# EAGLE schematic Arduino Dots Matrix (EAGLE 7.5.0)

## Sheet 1 of 3
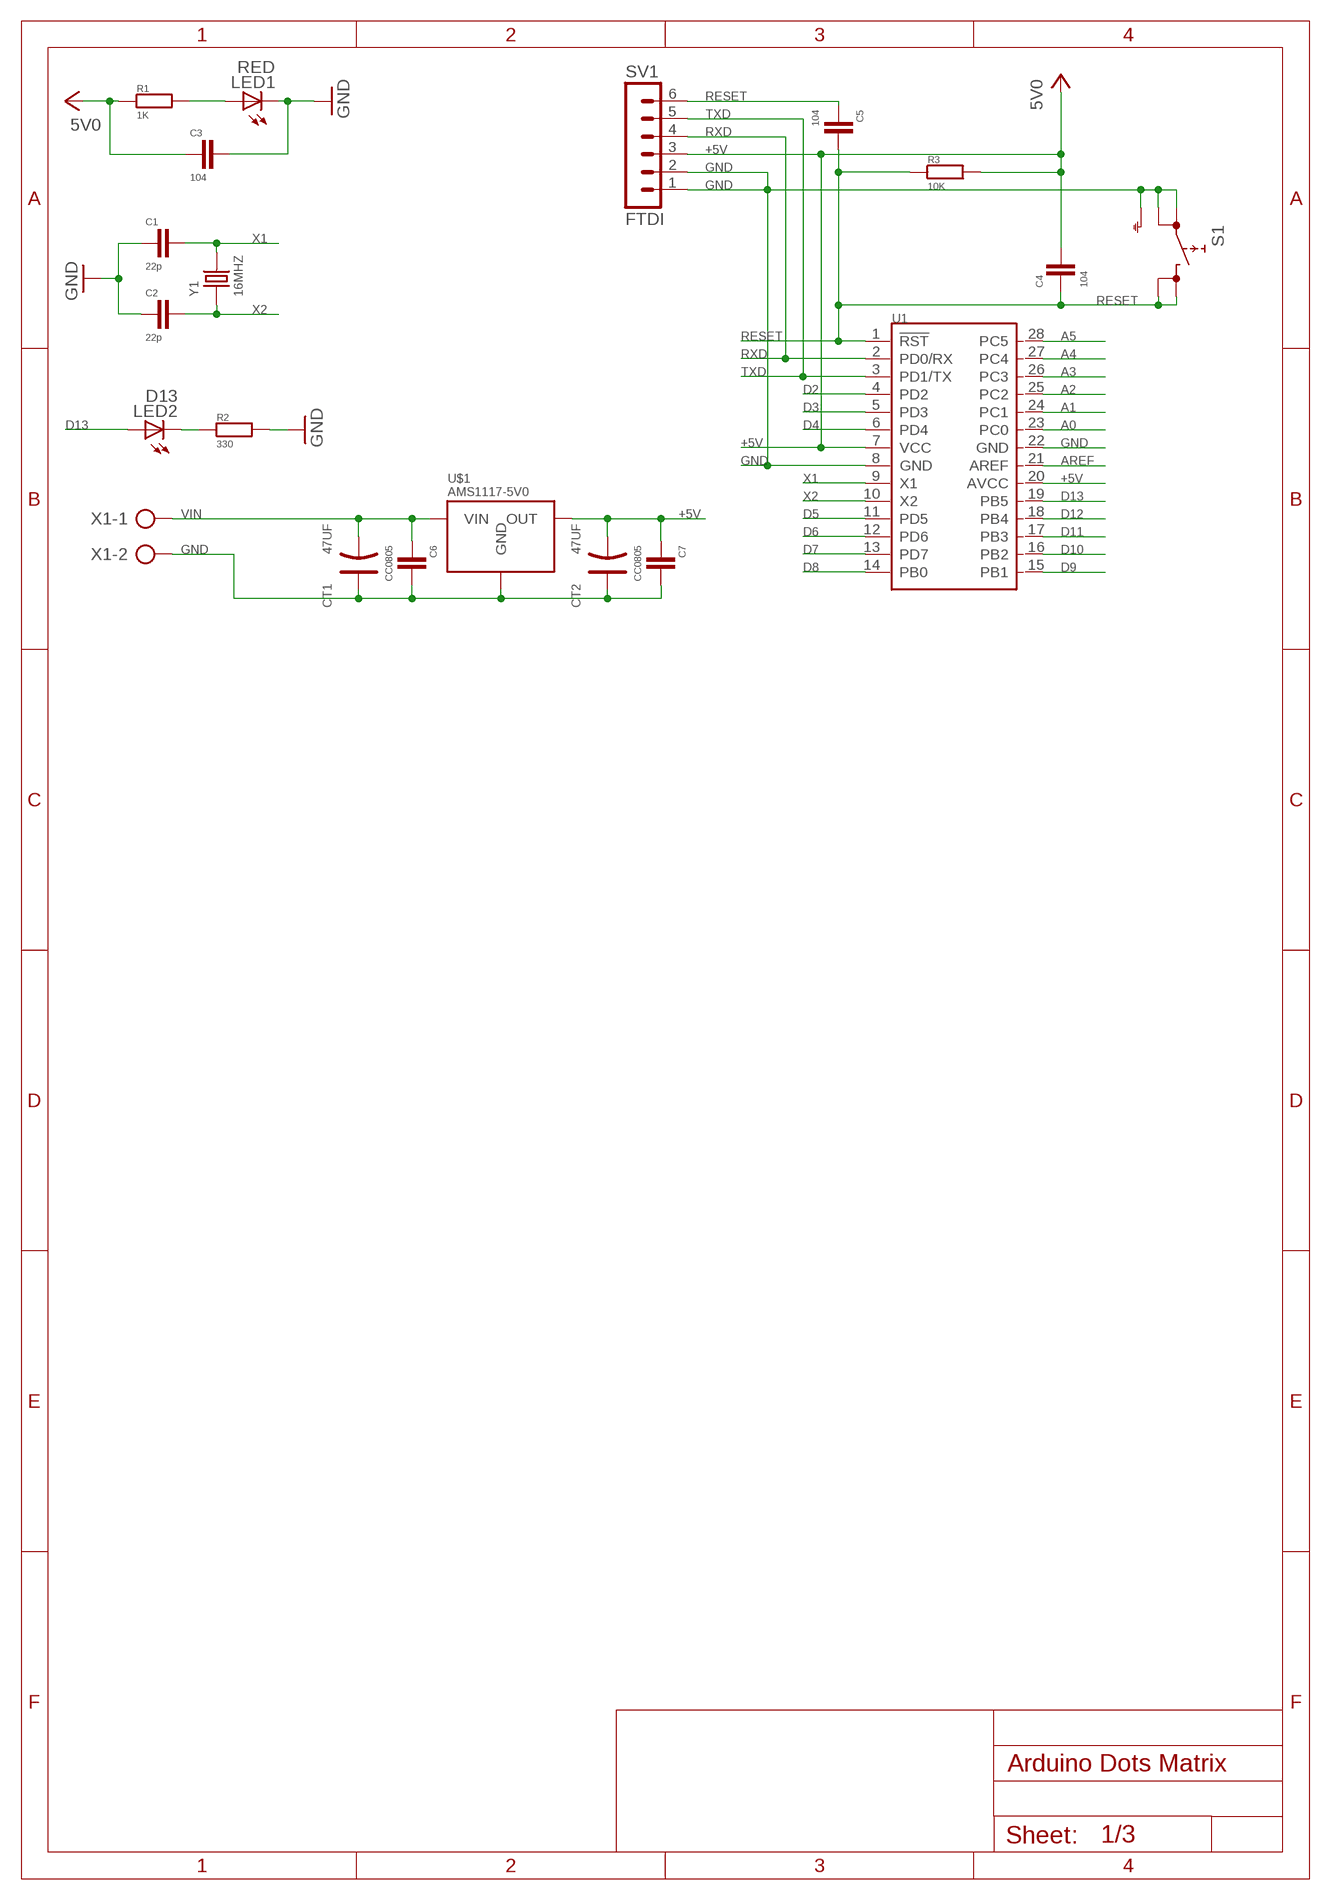
[diagram p0: schematic, sheet 1]

### Parts
C1  22p  CC0805  [C0805]
C2  22p  CC0805  [C0805]
C3  104  CC0805  [C0805]
C4  104  CC0805  [C0805]
C5  104  CC0805  [C0805]
C6  CC0805  [C0805]
C7  CC0805  [C0805]
CT1  47UF  ALUMINUM-SMD-47UF-25V(D6.3-H5.3MM)  [ELECTRO-SMD-C-6MM]
CT2  47UF  ALUMINUM-SMD-47UF-25V(D6.3-H5.3MM)  [ELECTRO-SMD-C-6MM]
LED1  RED  LEDCHIPLED_0805  [CHIPLED_0805]
LED2  D13  LEDCHIPLED_0805  [CHIPLED_0805]
R1  1K  RR0805  [R0805]
R2  330  RR0805  [R0805]
R3  10K  RR0805  [R0805]
S1  SKHMPSE010  [SKHMPXE010]
SV1  FTDI  MA06-1  [MA06-1]
U1  MCU-ATMEGA328P-PU(DIP28)  [DIP28-2.54-35.6X13.5MM]
U$1  AMS1117-5V0  AMS1117-5V0SOT22  [SOT223]
X1  AK500/2  [AK500/2]
Y1  16MHZ  DIP-CRYSTAL-16MHZ-18PF-30PPM-40R(HC49US)  [HC49US]

### Nets
+5V: C3.2 C4.1 C7.2 CT2.- R1.1 R3.2 SV1.3 U1.7(VCC) U1.20(AVCC) U$1.OUT ; supply symbol labelled 5V0 ; also sheet 2
A0: U1.23(PC0)
A1: U1.24(PC1)
A2: U1.25(PC2)
A3: U1.26(PC3)
A4: U1.27(PC4)
A5: U1.28(PC5)
AREF: U1.21(AREF)
D2: U1.4(PD2)
D3: U1.5(PD3)
D4: U1.6(PD4)
D5: U1.11(PD5)
D6: U1.12(PD6)
D7: U1.13(PD7)
D8: U1.14(PB0)
D9: U1.15(PB1)
D10: U1.16(PB2)
D11: U1.17(PB3)
D12: U1.18(PB4)
D13: LED2.A U1.19(PB5)
GND: C1.2 C2.2 C3.1 C6.1 C7.1 CT1.+ CT2.+ LED1.C R2.2 S1.1(1.1) S1.2(1.2) S1.5(SH) SV1.1 SV1.2 U1.8(GND) U1.22(GND) U$1.GND X1.2 ; also sheet 2
N$1: LED1.A R1.2
N$2: LED2.C R2.1
RESET: C4.2 C5.1 C5.2 R3.1 S1.3(2.1) S1.4(2.2) SV1.6 U1.1(!RST)
RXD: SV1.4 U1.2(PD0/RX)
TXD: SV1.5 U1.3(PD1/TX)
VIN: C6.2 CT1.- U$1.VIN X1.1
X1: C1.1 U1.9(X1) Y1.2
X2: C2.1 U1.10(X2) Y1.1

## Sheet 2 of 3
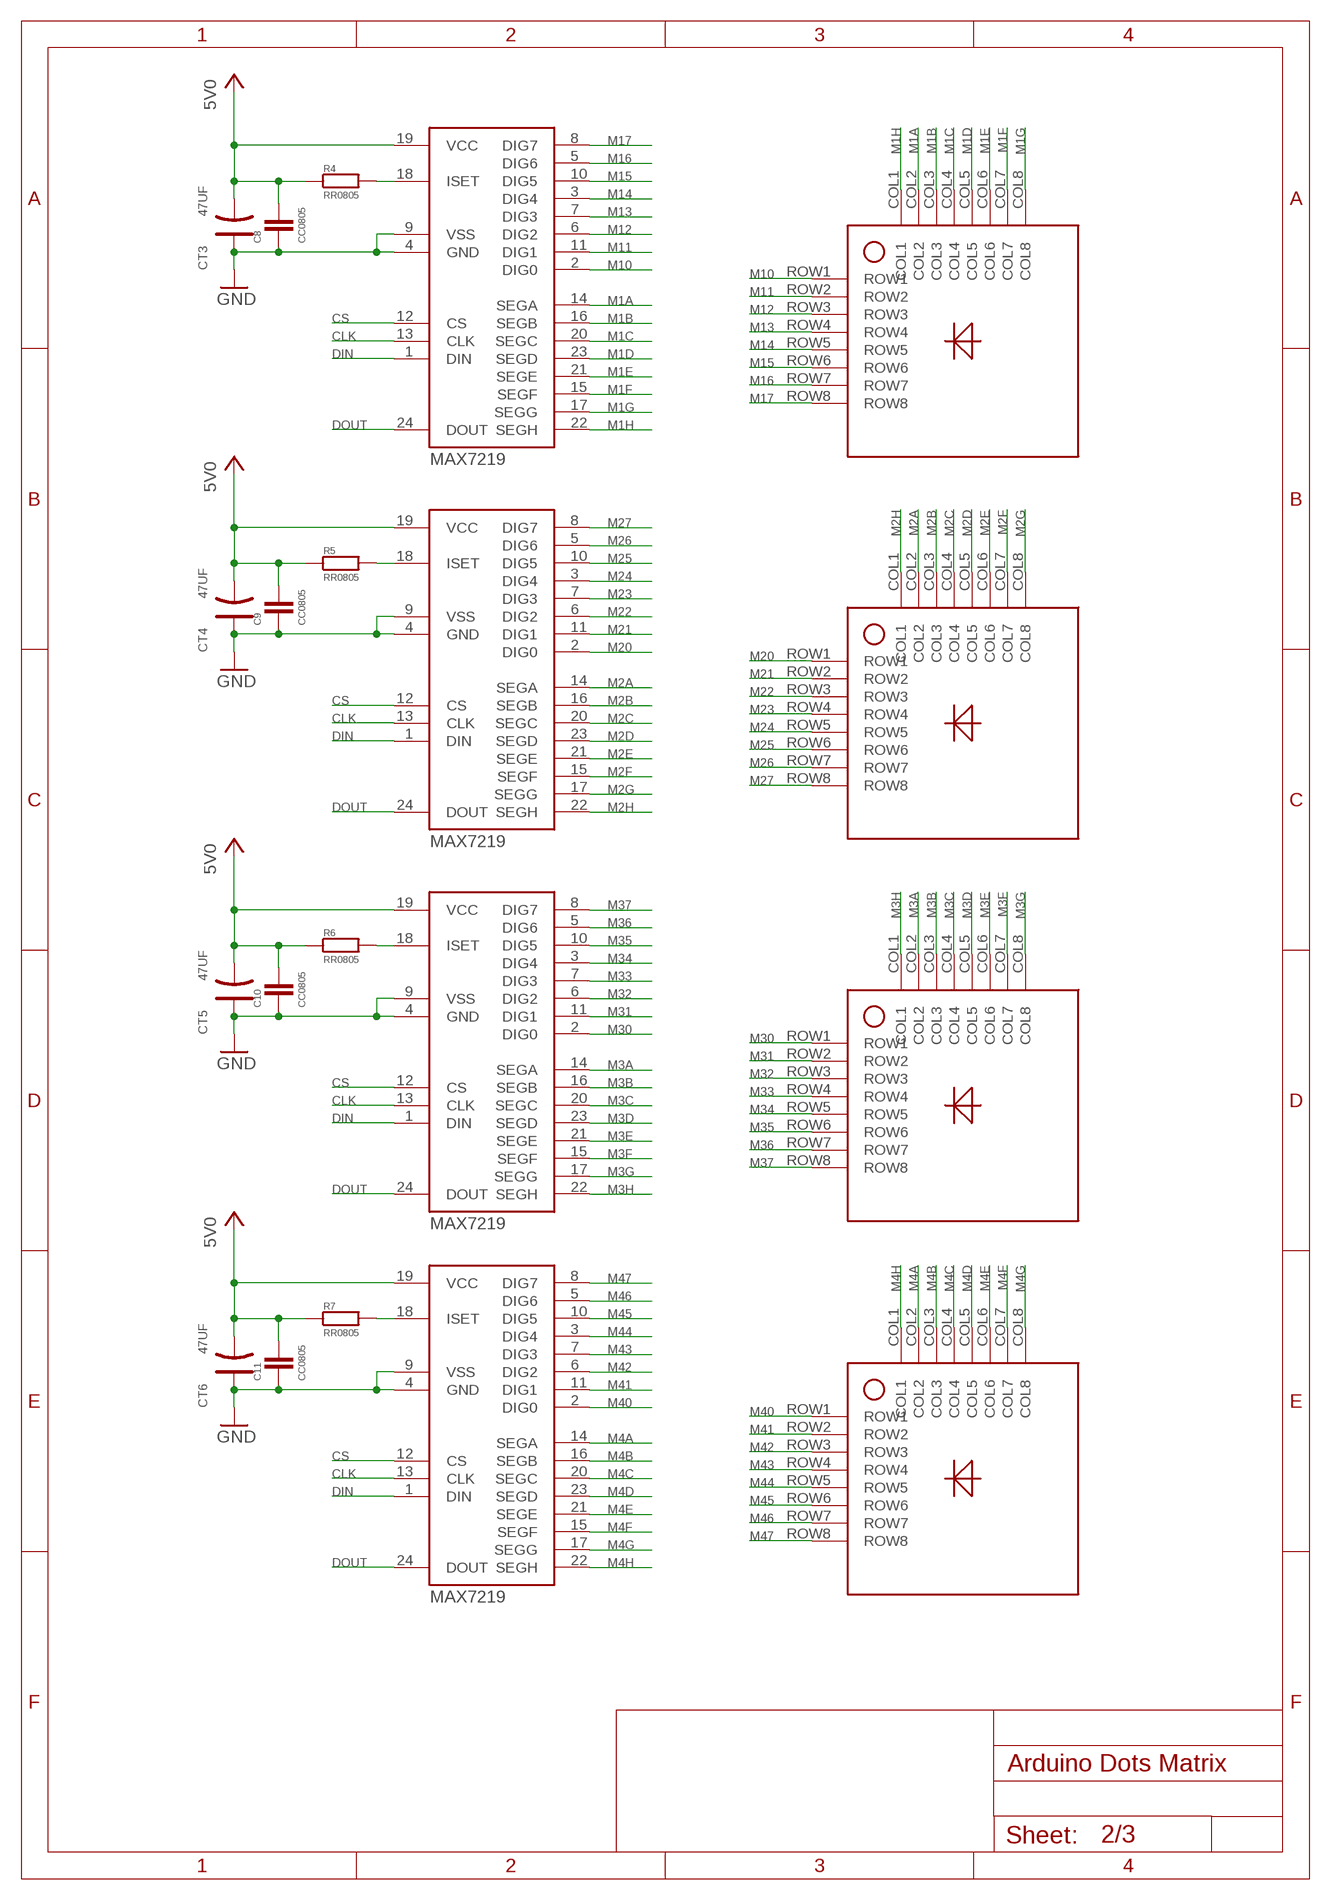
[diagram p1: schematic, sheet 2]

### Parts
C8  CC0805  [C0805]
C9  CC0805  [C0805]
C10  CC0805  [C0805]
C11  CC0805  [C0805]
CT3  47UF  ALUMINUM-SMD-47UF-25V(D6.3-H5.3MM)  [ELECTRO-SMD-C-6MM]
CT4  47UF  ALUMINUM-SMD-47UF-25V(D6.3-H5.3MM)  [ELECTRO-SMD-C-6MM]
CT5  47UF  ALUMINUM-SMD-47UF-25V(D6.3-H5.3MM)  [ELECTRO-SMD-C-6MM]
CT6  47UF  ALUMINUM-SMD-47UF-25V(D6.3-H5.3MM)  [ELECTRO-SMD-C-6MM]
D1  DOT-MATRIX-AS  [1088AS]
D2  DOT-MATRIX-AS  [1088AS]
D3  DOT-MATRIX-AS  [1088AS]
D4  DOT-MATRIX-AS  [1088AS]
M1  MAX7219  [SOP24]
M2  MAX7219  [SOP24]
M3  MAX7219  [SOP24]
M4  MAX7219  [SOP24]
R4  RR0805  [R0805]
R5  RR0805  [R0805]
R6  RR0805  [R0805]
R7  RR0805  [R0805]

### Nets
+5V: C8.1 C9.1 C10.1 C11.1 CT3.- CT4.- CT5.- CT6.- M1.19(VCC) M2.19(VCC) M3.19(VCC) M4.19(VCC) R4.1 R5.1 R6.1 R7.1 ; supply symbol labelled 5V0 ; also sheet 1
CLK: M1.13(CLK) M2.13(CLK) M3.13(CLK) M4.13(CLK)
CS: M1.12(CS) M2.12(CS) M3.12(CS) M4.12(CS)
DIN: M1.1(DIN) M2.1(DIN) M3.1(DIN) M4.1(DIN)
DOUT: M1.24(DOUT) M2.24(DOUT) M3.24(DOUT) M4.24(DOUT)
GND: C8.2 C9.2 C10.2 C11.2 CT3.+ CT4.+ CT5.+ CT6.+ M1.4(GND) M1.9(VSS) M2.4(GND) M2.9(VSS) M3.4(GND) M3.9(VSS) M4.4(GND) M4.9(VSS) ; also sheet 1
M1A: D1.COL2 M1.14(SEGA)
M1B: D1.COL3 M1.16(SEGB)
M1C: D1.COL4 M1.20(SEGC)
M1D: D1.COL5 M1.23(SEGD)
M1E: D1.COL6 M1.21(SEGE)
M1F: D1.COL7 M1.15(SEGF)
M1G: D1.COL8 M1.17(SEGG)
M1H: D1.COL1 M1.22(SEGH)
M2A: D2.COL2 M2.14(SEGA)
M2B: D2.COL3 M2.16(SEGB)
M2C: D2.COL4 M2.20(SEGC)
M2D: D2.COL5 M2.23(SEGD)
M2E: D2.COL6 M2.21(SEGE)
M2F: D2.COL7 M2.15(SEGF)
M2G: D2.COL8 M2.17(SEGG)
M2H: D2.COL1 M2.22(SEGH)
M3A: D3.COL2 M3.14(SEGA)
M3B: D3.COL3 M3.16(SEGB)
M3C: D3.COL4 M3.20(SEGC)
M3D: D3.COL5 M3.23(SEGD)
M3E: D3.COL6 M3.21(SEGE)
M3F: D3.COL7 M3.15(SEGF)
M3G: D3.COL8 M3.17(SEGG)
M3H: D3.COL1 M3.22(SEGH)
M4A: D4.COL2 M4.14(SEGA)
M4B: D4.COL3 M4.16(SEGB)
M4C: D4.COL4 M4.20(SEGC)
M4D: D4.COL5 M4.23(SEGD)
M4E: D4.COL6 M4.21(SEGE)
M4F: D4.COL7 M4.15(SEGF)
M4G: D4.COL8 M4.17(SEGG)
M4H: D4.COL1 M4.22(SEGH)
M10: D1.ROW1 M1.2(DIG0)
M11: D1.ROW2 M1.11(DIG1)
M12: D1.ROW3 M1.6(DIG2)
M13: D1.ROW4 M1.7(DIG3)
M14: D1.ROW5 M1.3(DIG4)
M15: D1.ROW6 M1.10(DIG5)
M16: D1.ROW7 M1.5(DIG6)
M17: D1.ROW8 M1.8(DIG7)
M20: D2.ROW1 M2.2(DIG0)
M21: D2.ROW2 M2.11(DIG1)
M22: D2.ROW3 M2.6(DIG2)
M23: D2.ROW4 M2.7(DIG3)
M24: D2.ROW5 M2.3(DIG4)
M25: D2.ROW6 M2.10(DIG5)
M26: D2.ROW7 M2.5(DIG6)
M27: D2.ROW8 M2.8(DIG7)
M30: D3.ROW1 M3.2(DIG0)
M31: D3.ROW2 M3.11(DIG1)
M32: D3.ROW3 M3.6(DIG2)
M33: D3.ROW4 M3.7(DIG3)
M34: D3.ROW5 M3.3(DIG4)
M35: D3.ROW6 M3.10(DIG5)
M36: D3.ROW7 M3.5(DIG6)
M37: D3.ROW8 M3.8(DIG7)
M40: D4.ROW1 M4.2(DIG0)
M41: D4.ROW2 M4.11(DIG1)
M42: D4.ROW3 M4.6(DIG2)
M43: D4.ROW4 M4.7(DIG3)
M44: D4.ROW5 M4.3(DIG4)
M45: D4.ROW6 M4.10(DIG5)
M46: D4.ROW7 M4.5(DIG6)
M47: D4.ROW8 M4.8(DIG7)
N$3: M1.18(ISET) R4.2
N$4: M2.18(ISET) R5.2
N$5: M3.18(ISET) R6.2
N$6: M4.18(ISET) R7.2

## Sheet 3 of 3
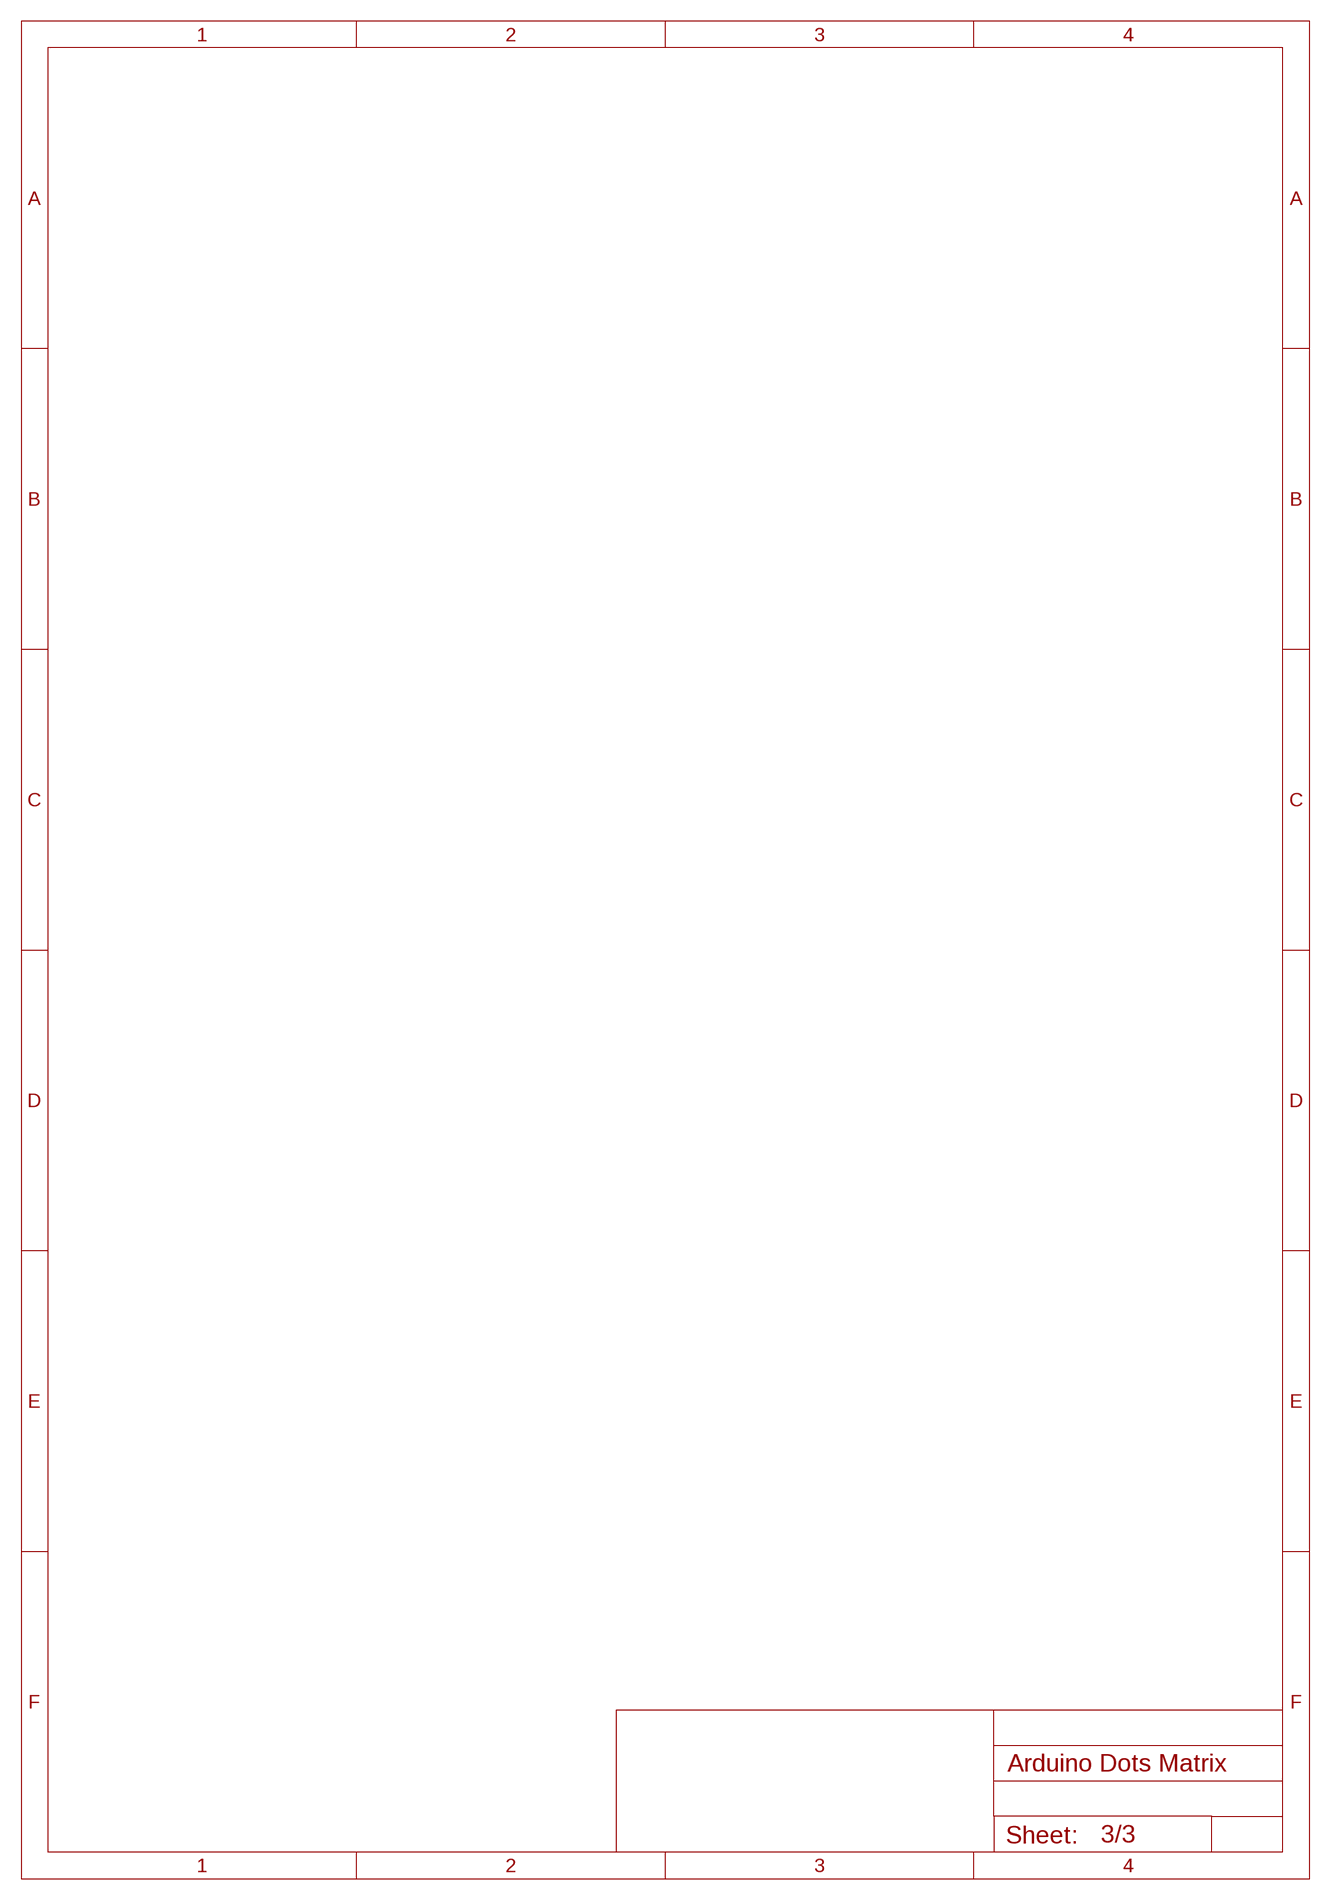
[diagram p2: schematic, sheet 3]

## Library data of the parts
C1-C11 = RCLDA:C: CAPACITOR
CT1-CT6 = RCLDA:ALUMINUM-SMD-47UF-25V(D6.3-H5.3MM): 302030059; MPN: CS1E470M-CRE54
D1-D4 = Display:DOT-MATRIX-AS
LED1 LED2 = Display:LED: LED OSRAM: - CHIPLED LG R971, LG N971, LY N971, LG Q971, LY Q971, LO R971, LY R971 LH N974, LH R974 LS Q976, LO Q976, LY Q976 LO Q996 - Hyper CHIPLED LW Q18S LB Q993, LB Q99A, LB R99A - SideLED LS A670, LO A670, LY A670, LG A670, LP A670 LB A673, LV A673, LT A673, LW A673 LH A674 LY A675 LS A676, LA A676, LO A676, LY A676, LW A676 LS A679, LY A679, LG A679 - Hyper Micro SIDELED® LS Y876, LA Y876, LO Y876, LY Y876 LT Y87S - SmartLED LW L88C, LW L88S LB L89C, LB L89S, LG L890 LS L89K, LO L89K, LY L89K LS L896, LA L896, LO L896, LY L896 - TOPLED LS T670, LO T670, LY T670, LG T670, LP T670 LSG T670, LSP T670, LSY T670, LOP T670, LYG T670 LG T671, LOG T671, LSG T671 LB T673, LV T673, LT T673, LW T673 LH T674 LS T676, LA T676, LO T676, LY T676, LB T676, LH T676, LSB T676, LW T676 LB T67C, LV T67C, LT T67C, LS T67K, LO T67K, LY T67K, LW E67C LS E67B, LA E67B, LO E67B, LY E67B, LB E67C, LV E67C, LT E67C LW T67C LS T679, LY T679, LG T679 LS T770, LO T770, LY T770, LG T770, LP T770 LB T773, LV T773, LT T773, LW T773 LH T774 LS E675, LA E675, LY E675, LS T675 LS T776, LA T776, LO T776, LY T776, LB T776 LHGB T686 LT T68C, LB T68C - Hyper Mini TOPLED® LB M676 - Mini TOPLED Santana® LG M470 LS M47K, LO M47K, LY M47K Source: http://www.osram.convergy.de LUXEON: - LUMILED® LXK2-PW12-R00, LXK2-PW12-S00, LXK2-PW14-U00, LXK2-PW14-V00 LXK2-PM12-R00, LXK2-PM12-S00, LXK2-PM14-U00 LXK2-PE12-Q00, LXK2-PE12-R00, LXK2-PE12-S00, LXK2-PE14-T00, LXK2-PE14-U00 LXK2-PB12-K00, LXK2-PB12-L00, LXK2-PB12-M00, LXK2-PB14-N00, LXK2-PB14-P00, LXK2-PB14-Q00 LXK2-PR12-L00, LXK2-PR12-M00, LXK2-PR14-Q00, LXK2-PR14-R00 LXK2-PD12-Q00, LXK2-PD12-R00, LXK2-PD12-S00 LXK2-PH12-R00, LXK2-PH12-S00 LXK2-PL12-P00, LXK2-PL12-Q00, LXK2-PL12-R00 Source: www.luxeon.com KINGBRIGHT: KA-3528ASYC Source: www.kingbright.com
M1-M4 = Chip:MAX7219
R1-R7 = RCLDA:R: RESISTOR
S1 = Button:SKHMP*E010: 6.2 X 6.5mm TACT Switch (SMD) Source: http://www3.alps.co.jp/WebObjects/catalog.woa/PDF/E/Switch/Tact/SKHM/SKHM.PDF
SV1 = Pin-Header:MA06-1: PIN HEADER; OC_FARNELL: unknown; OC_NEWARK: unknown
U1 = Chip:MCU-ATMEGA328P-PU(DIP28): 310010051; MPN: ATMEGA328P-PU; VALUE-DIP28: ATMEGA328P-PU
U$1 = Chip:AMS1117-5V0
X1 = Connector:AK500/2: CONNECTOR; OC_FARNELL: unknown; OC_NEWARK: unknown
Y1 = Crystal:DIP-CRYSTAL-16MHZ-18PF-30PPM-40R(HC49US): 306010014; MPN: HC-49US 16.000MHz